# EAGLE design AK4493_Breakout (EAGLE 9.6.2)
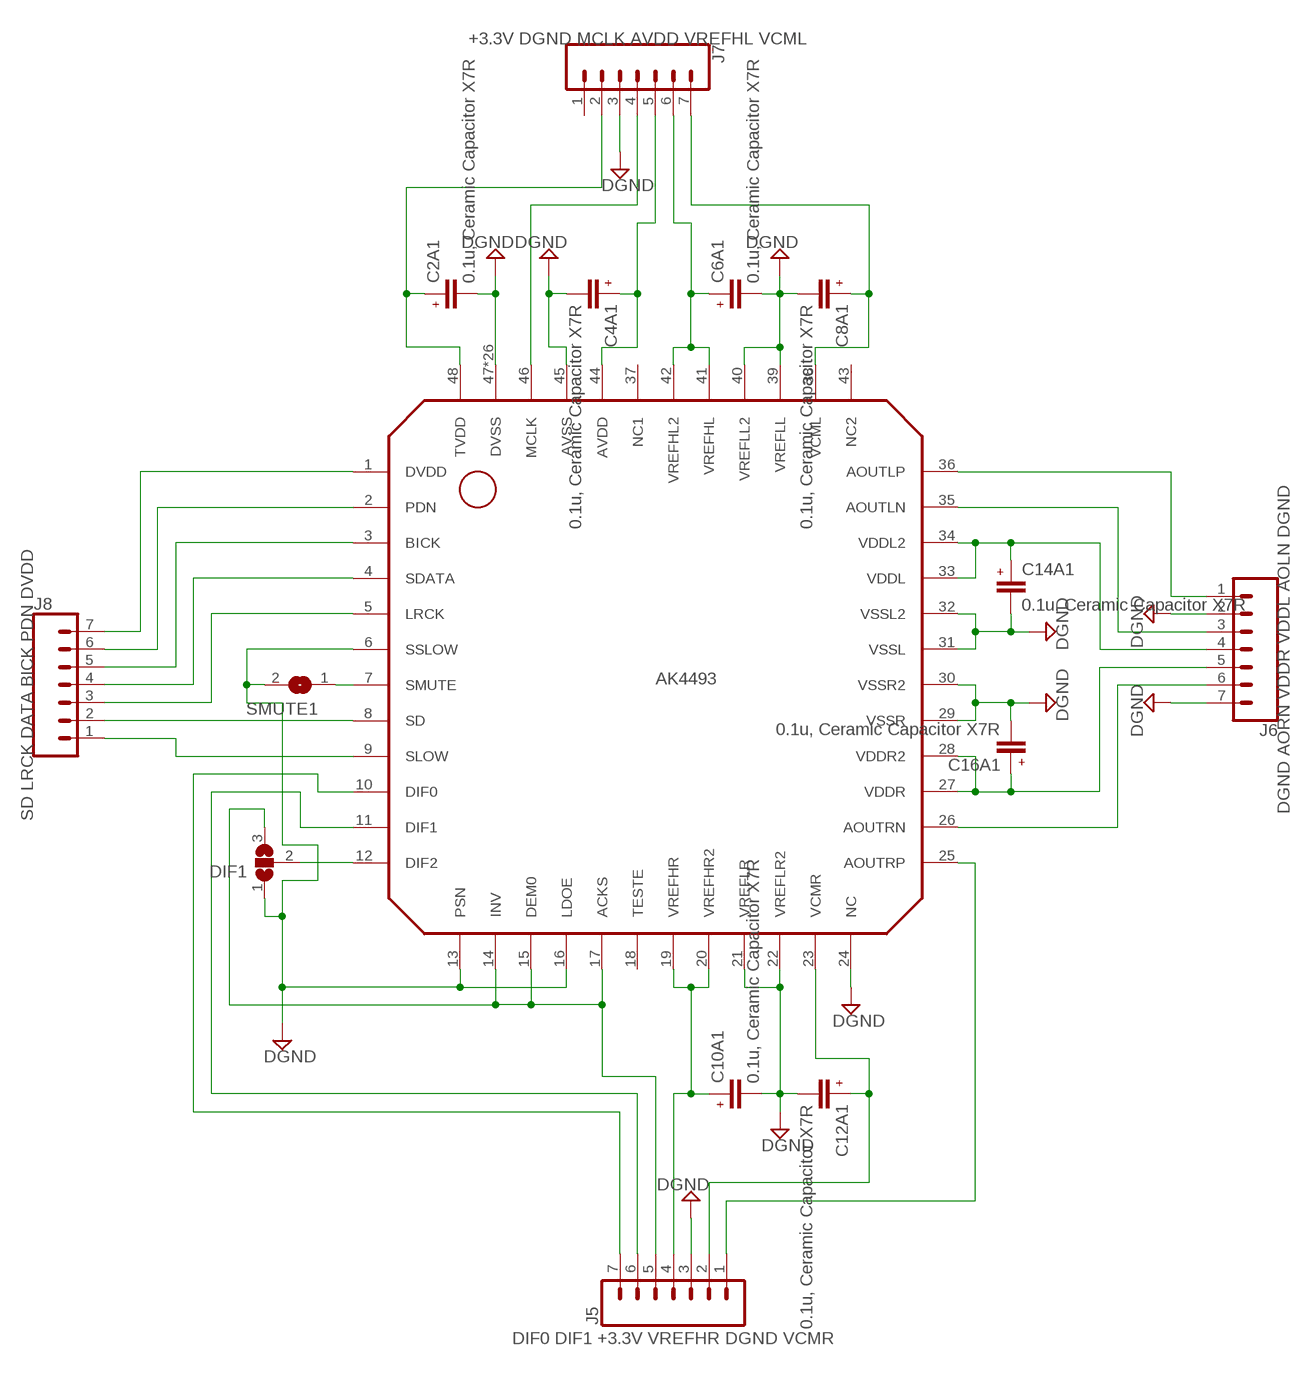
[diagram p0: schematic, sheet 1]

## Parts
C2A1  0.1u, Ceramic Capacitor X7R  C-POL-MLCCC0603K  [C0603K]
C4A1  0.1u, Ceramic Capacitor X7R  C-POL-MLCCC0603K  [C0603K]
C6A1  0.1u, Ceramic Capacitor X7R  C-POL-MLCCC0603K  [C0603K]
C8A1  0.1u, Ceramic Capacitor X7R  C-POL-MLCCC0603K  [C0603K]
C10A1  0.1u, Ceramic Capacitor X7R  C-POL-MLCCC0603K  [C0603K]
C12A1  0.1u, Ceramic Capacitor X7R  C-POL-MLCCC0603K  [C0603K]
C14A1  0.1u, Ceramic Capacitor X7R  C-POL-MLCCC0603K  [C0603K]
C16A1  0.1u, Ceramic Capacitor X7R  C-POL-MLCCC0603K  [C0603K]
DIF1  SJ2W  [SJ_2]
IC2  AK4493  [LQFP48_]
J5  CONN_07  [1X07]
J6  CONN_07  [1X07]
J7  CONN_07  [1X07]
J8  CONN_07  [1X07]
SMUTE1  SJ  [SJ]

## Nets
DGND: C2A1.2 C2A1.DGND C4A1.2 C4A1.DGND C6A1.2 C6A1.DGND C8A1.2 C8A1.DGND C10A1.2 C10A1.DGND C12A1.2 C12A1.DGND C14A1.2 C14A1.DGND C16A1.2 C16A1.DGND DIF1.1 IC2.6(SSLOW) IC2.13(PSN) IC2.16(LDOE) IC2.21(VREFLR) IC2.22(VREFLR2) IC2.24(NC) IC2.29(VSSR) IC2.30(VSSR2) IC2.31(VSSL) IC2.32(VSSL2) IC2.39(VREFLL) IC2.40(VREFLL2) IC2.45(AVSS) IC2.47(DVSS) IC2.P$1(DVSS) IC2.P$2(DVSS) IC2.P$3(DVSS) IC2.P$4(DVSS) IC2.P$5(DVSS) IC2.P$6(DVSS) IC2.P$7(DVSS) IC2.P$8(DVSS) IC2.P$9(DVSS) IC2.P$10(DVSS) IC2.P$11(DVSS) IC2.P$12(DVSS) IC2.P$13(DVSS) IC2.P$14(DVSS) IC2.P$15(DVSS) IC2.P$16(DVSS) IC2.P$17(DVSS) IC2.P$18(DVSS) IC2.P$19(DVSS) IC2.P$20(DVSS) IC2.P$21(DVSS) IC2.P$22(DVSS) IC2.P$23(DVSS) IC2.P$24(DVSS) IC2.P$25(DVSS) J5.3 J6.2 J6.7 J7.3 SMUTE1.2
N$24 [L_Audio]: IC2.36(AOUTLP) J6.1
N$27 [L_Audio]: IC2.35(AOUTLN) J6.3
N$28 [R_Audio]: IC2.25(AOUTRP) J5.1
N$29 [R_Audio]: IC2.26(AOUTRN) J6.6
N$30: IC2.9(SLOW) J8.1
N$31: IC2.10(DIF0) J5.7
N$32: IC2.5(LRCK) J8.3
N$33: IC2.4(SDATA) J8.4
N$34: IC2.3(BICK) J8.5
N$35: IC2.46(MCLK) J7.4
N$36: IC2.1(DVDD) J8.7
N$37: C4A1.1 IC2.44(AVDD) J7.5
N$38: IC2.2(PDN) J8.6
N$39: C8A1.1 IC2.38(VCML) J7.7
N$40: C12A1.1 IC2.23(VCMR) J5.2
N$41: C6A1.1 IC2.41(VREFHL) IC2.42(VREFHL2) J7.6
N$42: DIF1.2 IC2.12(DIF2)
N$43: IC2.7(SMUTE) SMUTE1.1
N$44: IC2.8(SD) J8.2
N$45: IC2.11(DIF1) J5.6
N$46: C10A1.1 IC2.19(VREFHR) IC2.20(VREFHR2) J5.4
N$47: C14A1.1 IC2.33(VDDL) IC2.34(VDDL2) J6.4
N$48: C16A1.1 IC2.27(VDDR) IC2.28(VDDR2) J6.5
N$49: C2A1.1 IC2.48(TVDD) J7.2
N$50: DIF1.3 IC2.14(INV) IC2.15(DEM0) IC2.17(ACKS) J5.5
Unconnected: IC2.18(TESTE) IC2.37(NC1) IC2.43(NC2) J7.1

## Notes on the sheet
- +3.3V DGND MCLK AVDD VREFHL VCML
- DGND AORN VDDR VDDL AOLN DGND
- SD LRCK DATA BICK PDN DVDD
- DIF0 DIF1 +3.3V VREFHR DGND VCMR

## Library data of the parts
C2A1 C4A1 C6A1 C8A1 C10A1 C12A1 C14A1 C16A1 = Dual Mono Amp Library:C-POL-MLCC: CAPACITOR, European symbol; SPICEPREFIX: C
DIF1 = Dual Mono Amp Library:SJ2W: SMD solder JUMPER
IC2 = Dual Mono Amp Library:AK4493: Quality Oriented 32-Bit 2ch DAC 32-Bit, 768 kHz with VELVET SOUND
J5-J8 = Dual Mono Amp Library:CONN_07: Multi connection point. Often used as Generic Header-pin footprint for 0.1 inch spaced/style header connections On any of the 0.1 inch spaced packages, you can populate with these: Break Away Headers - Straight <https://www.sparkfun.com/products/116> (PRT-00116) Break Away Male Headers - Right Angle <https://www.sparkfun.com/products/553> (PRT-00553) Female Headers <https://www.sparkfun.com/products/115> (PRT-00115) Break Away Headers - Machine Pin <https://www.sparkfun.com/products/117> (PRT-00117) Break Away Female Headers - Swiss Machine Pin <https://www.sparkfun.com/products/743> (PRT-00743) For SCREWTERMINALS and SPRING TERMINALS visit here: Screw Terimnals on SparkFun.com <https://www.sparkfun.com/search/results?term=Screw+Terminals> (5mm/3.5mm/2.54mm spacing) This device is also useful as a general connection point to wire up your design to another part of your project. Our various solder wires solder well into these plated through hole pads. Hook-Up Wire - Assortment (Stranded, 22 AWG) <https://www.sparkfun.com/products/11375> (PRT-11375) Hook-Up Wire - Assortment (Solid Core, 22 AWG) <https://www.sparkfun.com/products/11367> (PRT-11367) View the entire wire category on our website here <https://www.sparkfun.com/categories/141> Special notes: Molex polarized connector foot print use with SKU : PRT-08231 with associated crimp pins and housings. 1MM SMD Version SKU: PRT-10208 NOTES ON THE VARIANTS LOCK and LOCK_LONGPADS... This footprint was designed to help hold the alignment of a through-hole component (i.e. 6-pin header) while soldering it into place. You may notice that each hole has been shifted either up or down by 0.005 of an inch from it's more standard position (which is a perfectly straight line). This slight alteration caused the pins (the squares in the middle) to touch the edges of the holes. Because they are alternating, it causes a "brace" to hold the component in place. 0.005 has proven to be the perfect amount of "off-center" position when using our standard breakaway headers. Although looks a little odd when you look at the bare footprint, once you have a header in there, the alteration is very hard to notice. Also,if you push a header all the way into place, it is covered up entirely on the bottom side.; PROD_ID: Combine 8288+14485
SMUTE1 = Dual Mono Amp Library:SJ: SMD solder JUMPER

## Board
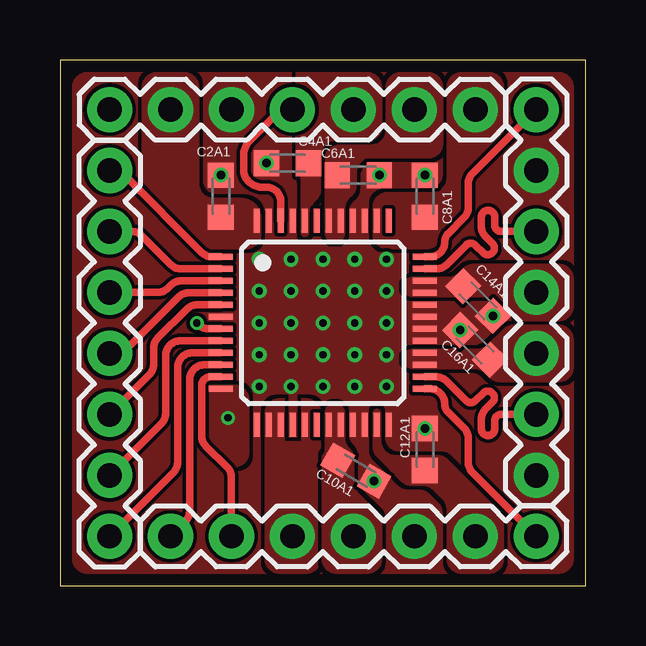
[diagram p1: board, top side]
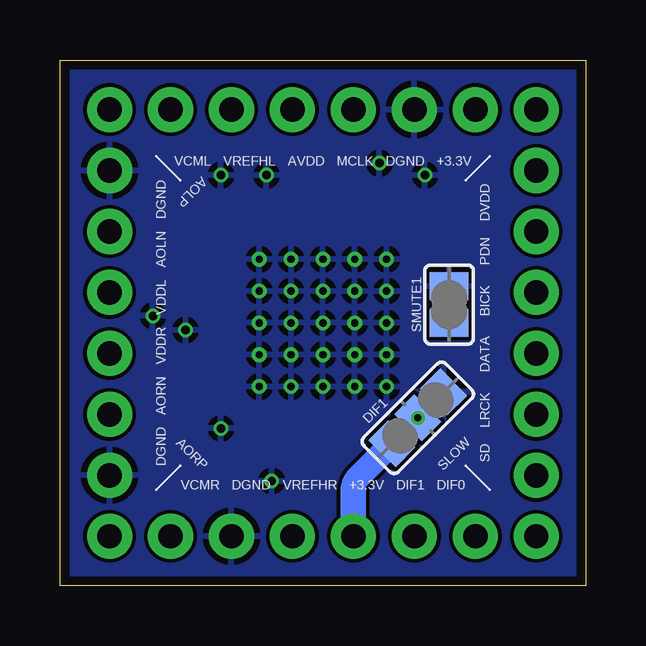
[diagram p2: board, bottom side, seen from below]

Size 21.91 x 21.91 mm. Coordinates in mm from the lower left corner, seen from the top.
Outline: 0,0 21.91,0
Outline: 21.91,0 21.91,21.91
Outline: 21.91,21.91 0,21.91
Outline: 0,21.91 0,0
Outline: 0,21.91 0,0
Outline: 0,0 21.91,0
Outline: 21.91,0 21.91,21.91
Outline: 21.91,21.91 0,21.91
Copper layers (1*16): Top 0.035559375mm / dielectric 1.6mm / Bottom 0.035559375mm
Design rules "oshpark-2layer": minimum track width 6mil, minimum drill 10mil, track to track 6mil, track to pad 6mil, pad to pad 6mil, via to via 6mil, smd to smd 6mil, copper to edge 15mil, drill to drill 6mil, minimum pad ring 5mil, minimum via ring 5mil, stop-mask expansion 2.5mil, vias tented up to drill 0mil, thermal gap 10mil

### Footprints (pad centres in the part's own frame; a part is rotated, then mirrored left to right if it is on the bottom)
C0603K = smd 1.05 x 1.08: 1 -0.875,0; 2 0.875,0 | drill 0.35: DGND 0.875,0
SJ_2 = smd 1.168 x 1.6: 1 -1.524,0; 2 0,0; 3 1.524,0
LQFP48_ = smd 0.25 x 1: 1 -2.75,-4.25; 2 -2.25,-4.25; 3 -1.75,-4.25; 4 -1.25,-4.25; 5 -0.75,-4.25; 6 -0.25,-4.25; 7 0.25,-4.25; 8 0.75,-4.25; 9 1.25,-4.25; 10 1.75,-4.25; 11 2.25,-4.25; 12 2.75,-4.25; 25 2.75,4.25; 26 2.25,4.25; 27 1.75,4.25; 28 1.25,4.25; 29 0.75,4.25; 30 0.25,4.25; 31 -0.25,4.25; 32 -0.75,4.25; 33 -1.25,4.25; 34 -1.75,4.25; 35 -2.25,4.25; 36 -2.75,4.25 | smd 1 x 0.25: 13 4.25,-2.75; 14 4.25,-2.25; 15 4.25,-1.75; 16 4.25,-1.25; 17 4.25,-0.75; 18 4.25,-0.25; 19 4.25,0.25; 20 4.25,0.75; 21 4.25,1.25; 22 4.25,1.75; 23 4.25,2.25; 24 4.25,2.75; 37 -4.25,2.75; 38 -4.25,2.25; 39 -4.25,1.75; 40 -4.25,1.25; 41 -4.25,0.75; 42 -4.25,0.25; 43 -4.25,-0.25; 44 -4.25,-0.75; 45 -4.25,-1.25; 46 -4.25,-1.75; 47 -4.25,-2.25; 48 -4.25,-2.75 | drill 0.305 pad 0.61: P$1 0,0; P$2 -1.327,0; P$3 -2.655,0; P$4 1.327,0; P$5 2.655,0; P$6 0,1.327; P$7 0,2.655; P$8 0,-1.327; P$9 0,-2.655; P$10 -1.327,-1.327; P$11 -2.655,-1.327; P$12 -2.655,-2.655; P$13 -1.327,-2.655; P$14 1.327,-2.655; P$15 2.655,-2.655; P$16 2.655,-1.327; P$17 1.327,-1.327; P$18 1.327,1.327; P$19 2.655,1.327; P$20 2.655,2.655; P$21 1.327,2.655; P$22 -1.327,2.655; P$23 -2.655,2.655; P$24 -2.655,1.327; P$25 -1.327,1.327
1X07 = drill 1.016 pad 1.88: 1 0,0; 2 2.54,0; 3 5.08,0; 4 7.62,0; 5 10.16,0; 6 12.7,0; 7 15.24,0
SJ = smd 1.168 x 1.6: 1 -0.762,0; 2 0.762,0

### Placement (x,y rotation side)
C2A1  6.71,16.24 90 top
C4A1  9.48,17.61 180 top
C6A1  12.43,17.11 0 top
C8A1  15.21,16.24 90 top
C10A1  12.33,4.8 330 top
C12A1  15.21,5.68 90 top
C14A1  17.42,11.87 315 top
C16A1  17.3,10.04 135 top
DIF1  7,7 225 bottom
IC2  10.96,10.96 270 top
J5  19.84,2.06 180 top
J6  19.84,19.84 270 top
J7  2.06,19.84 0 top
J8  2.06,2.06 90 top
SMUTE1  5.7,11.72 90 bottom

### Tracks (layer width: path | path; a pad name or v marks a point on that pad's centre or on a via)
DGND
  pour Top (rank 6, no thermals): 1.12,21.4 20.79,21.4 arc-90 21.4,20.79 21.4,1.12 arc-90 20.79,0.51 1.12,0.51 arc-90 0.51,1.12 0.51,20.79 arc-90
  pour Bottom: 0,21.91 21.91,21.91 21.91,0 0,0
  pour Top (no thermals): 9.53,8.1 9.53,6.2 9.88,6.2 9.88,8.1
N$24
  Top 0.305: IC2.36 15.41,13.71 arc90 16.02,14.31 arc-45 16.17,14.67 16.83,15.33 arc45 17.01,15.76 17.01,16.76 arc-45 17.19,17.19 J6.1
N$27
  Top 0.305: IC2.35 15.68,13.21 arc45 16.11,13.38 16.92,14.19 arc-90 17.31,14.19 17.63,13.88 arc180 18.02,14.27 17.74,14.54 arc-45 17.56,14.97 17.56,15.38 arc-180 18.11,15.38 18.11,15.04 arc90 18.39,14.77 J6.3
N$28
  Top 0.305: IC2.25 15.41,8.21 arc-90 16.02,7.59 arc45 16.17,7.24 16.83,6.58 arc-45 17.01,6.15 17.01,5.15 arc45 17.19,4.72 J5.1
N$29
  Top 0.305: IC2.26 15.68,8.71 arc-45 16.11,8.53 16.92,7.72 arc90 17.31,7.72 17.63,8.03 arc-180 18.02,7.64 17.74,7.37 arc45 17.56,6.94 17.56,6.54 arc180 18.11,6.54 18.11,6.87 arc-90 18.39,7.14 J6.6
N$30
  Top 0.305: IC2.9 5.51,9.71 arc90 4.9,9.1 4.9,5.15 arc-45 4.72,4.72 J8.1
N$31
  Top 0.305: IC2.10 6.01,9.21 arc90 5.4,8.6 5.4,3.11 arc-45 5.22,2.68 J5.7
N$32
  Top 0.305: IC2.5 5.71,11.71 arc45 5.28,11.53 4.08,10.33 arc45 3.9,9.9 3.9,9.23 arc-45 3.72,8.8 J8.3
N$33
  Top 0.305: IC2.4 5.36,12.21 arc45 4.93,12.03 2.76,9.86 arc-45 2.33,9.69 J8.4
N$34
  Top 0.305: IC2.3 5.05,12.71 arc45 4.62,12.53 4.49,12.4 arc-45 4.06,12.22 J8.5
N$35
  Top 0.305: J7.4 9.61,19.84 arc45 8.9,19.55 7.94,18.59 arc45 7.65,17.89 7.65,17.36 arc90 8.4,16.61 8.6,16.61 arc-90 9.21,16 IC2.46
N$36
  Top 0.305: IC2.1 6.35,13.71 arc-45 5.92,13.88 2.67,17.13 arc45 2.24,17.3 J8.7
N$37
  pour Top (no thermals): 12.81,21.4 9.83,21.4 9.83,17.35 arc45 9.92,17.13 9.94,17.11 arc-45 10.03,16.89 10.03,14.71 arc180 10.38,14.71 10.38,15.36 arc-45 10.67,16.06 arc45 10.88,16.56 10.88,17.93 arc-90 11.49,18.54 12.81,18.54 arc90 13.42,19.15 13.42,20.79 arc90
N$38
  Top 0.305: IC2.2 5.05,13.21 arc-45 4.62,13.38 3.41,14.59 arc45 2.98,14.77 J8.6
N$39
  pour Top (no thermals): 16.11,17.01 16.11,20.79 arc-90 16.72,21.4 17.89,21.4 arc-90 18.5,20.79 18.5,18.75 arc-45 18.32,18.32 17.19,17.19 arc45 17.01,16.76 17.01,15.76 arc-45 16.83,15.33 15.71,14.21 arc-45 15.28,14.03 13.64,14.03 arc-90 13.03,14.64 13.03,15.79 arc-90 13.64,16.4 15.5,16.4 arc90
N$40
  pour Top (no thermals): 15.54,3.99 15.93,3.6 arc-45 16.11,3.17 16.11,1.12 arc90 16.72,0.51 17.89,0.51 arc90 18.5,1.12 18.5,2.68 arc45 18.32,3.11 16.17,5.27 arc45 15.73,5.45 13.99,5.45 arc-90 13.38,6.06 13.38,7.2 arc180 13.03,7.2 13.03,5.78 arc45 13.21,5.35 14.22,4.34 arc45 14.65,4.16 15.11,4.16 arc-45
N$41
  pour Top (no thermals): 13.57,19 13.57,20.79 arc-90 14.18,21.4 15.35,21.4 arc-90 15.96,20.79 15.96,18.42 arc-90 15.35,17.81 12.97,17.81 arc90 12.36,17.2 12.36,16.69 arc-45 12.18,16.26 12.06,16.14 arc45 11.88,15.71 11.88,14.71 arc-180 11.03,14.71 11.03,17.78 arc-90 11.64,18.39 12.96,18.39 arc90
N$42  (via drill 0.3)
  other vias: 7,7
  pour Top (no thermals): 7.88,5.54 7.88,7.77 arc90 7.27,8.38 5.9,8.38 5.9,6.19 arc45 6.08,5.75 6.72,5.11 arc45 7.15,4.93 7.27,4.93 arc90
N$43  (via drill 0.3)
  Top 0.305: IC2.7 6.2,10.71 arc-45 5.77,10.88 SMUTE1.1
  other vias: 5.7,10.96
N$44
  Top 0.305: IC2.8 5.01,10.21 arc90 4.4,9.6 4.4,7.19 arc-45 4.22,6.76 J8.2
N$45
  Top 0.305: IC2.11 6.26,8.71 arc90 5.9,8.35 5.9,6.25 arc45 6.08,5.82 6.97,4.93 arc-45 7.14,4.5 J5.6
N$46
  pour Top (no thermals): 11.03,7.2 11.03,5.65 arc-45 10.96,5.48 arc45 10.9,5.34 10.9,1.12 arc90 11.51,0.51 12.81,0.51 arc90 13.42,1.12 13.42,2.65 arc45 13.24,3.08 12.43,3.89 arc-45 12.25,4.32 12.25,5.29 arc45 12.08,5.72 12.06,5.74 arc-45 11.88,6.17 11.88,7.2 arc180
N$47
  pour Top (no thermals): 14.71,12.88 arc180 14.71,12.03 17.9,12.03 arc-45 18.33,11.85 18.97,11.21 arc45 19.4,11.03 20.79,11.03 arc90 21.4,11.64 21.4,12.81 arc90 20.79,13.42 17.23,13.42 arc45 16.8,13.24 16.62,13.06 arc-45 16.19,12.88
N$48
  pour Top (no thermals): 14.71,9.03 arc-180 14.71,9.88 17.39,9.88 arc45 17.82,10.06 18.46,10.7 arc-45 18.89,10.88 20.79,10.88 arc-90 21.4,10.27 21.4,9.1 arc-90 20.79,8.49 18.32,8.49 arc-45 17.89,8.67 17.71,8.85 arc45 17.28,9.03
N$49
  pour Top (no thermals): 5.19,21.4 4.02,21.4 arc90 3.41,20.79 3.41,16.64 arc45 3.64,16.09 5.52,14.21 arc45 5.95,14.03 7.77,14.03 arc90 8.38,14.64 8.38,15.36 arc90 7.58,16.16 6.41,16.16 arc-90 5.8,16.77 5.8,20.79 arc90
N$50
  Bottom 1.016: 9.69,4.06 arc45 9.51,4.49 DIF1.3
  Bottom 1.06: J5.5 9.69,4.06
  pour Top (rank 2, no thermals): 10.88,1.12 10.88,7.2 arc90 10.27,7.81 9.14,7.81 arc90 8.53,7.2 8.53,1.12 arc90 9.14,0.51 10.27,0.51 arc90

### Text on the board
bNames: VCML VREFHL AVDD MCLK DGND +3.3V | AOLP | SD LRCK DATA BICK PDN DVDD | DGND AORN VDDR VDDL AOLN DGND | SLOW | AORP | VCMR DGND VREFHR +3.3V DIF1 DIF0